# Altium schematic sheet ldo1.1.SchDoc
size A4; SheetNumber: 7; SheetTotal: 9
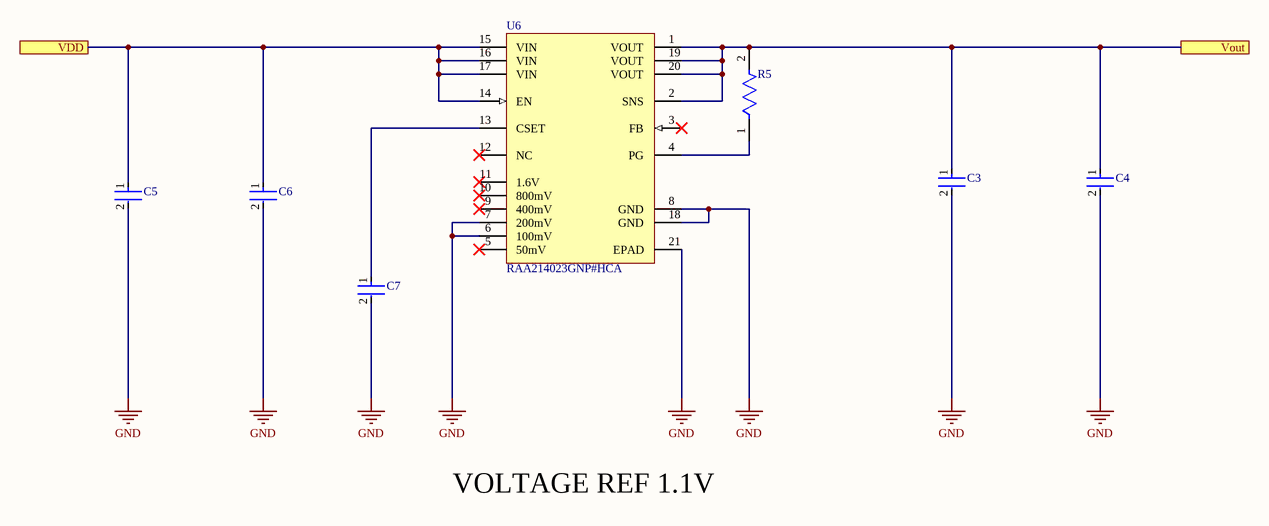
[diagram p0: ldo1.1.SchDoc]

## Parts
C3  CL21A226MOCLRNC  [FP-CL21-IPC_C]  (value not drawn)
C4  C0805C104K4RAC  [FP-C0805C-DN-MFG]  (value not drawn)
C5  0.1 uF C0805C104K4RAC  [FP-C0805C-DN-MFG]  (value not drawn)
C6  CL21A106KOQNNNG  [FP-CL21-IPC_C]  (value not drawn)
C7  C0805C104K4RAC  [FP-C0805C-DN-MFG]  (value not drawn)
R5  RC1005F103CS  [FP-RC1005-IPC_B]  (value not drawn)
U6  RAA214023GNP#HCA  [L20_3_5x3_5_MFG]

## Ports
VDD (see THE_FIRST[10G], DP10[1B], DP[2B], LDO3.3[1B], ldo[1B], lm334sm[2B]), Vout (see THE_FIRST[9G])

## Nets
GND: C3.2 C4.2 C5.2 C6.2 C7.2 U6.6(100mV) U6.7(200mV) U6.8(GND) U6.18(GND) U6.21(EPAD)
VDD: C5.1 C6.1 U6.14(EN) U6.15(VIN) U6.16(VIN) U6.17(VIN) ; port VDD
Vout: C3.1 C4.1 R5.2 U6.1(VOUT) U6.2(SNS) U6.19(VOUT) U6.20(VOUT) ; port Vout
NetC7_1: C7.1 U6.13(CSET)
NetR5_1: R5.1 U6.4(PG)

Not connected (* = marked no-connect by the designer): U6 3(FB)* 5(50mV)* 9(400mV)* 10(800mV)* 11(1.6V)* 12(NC)*

## Notes on the sheet
- VOLTAGE REF 1.1V

## Library data of the parts
C3 = CMP-13271-002990-1: CL21 Series 0805 22uF 16V ±20% Tolerance X5R Multilayer Ceramic Chip Capacitor; Case Code (Imperial): 0805; Capacitance: 22uF; Max Operating Temperature: 85°C; Min Operating Temperature: -55°C; Packaging: Tape and Reel; Case Code (Metric): 2012; Case/Package: 0805; Mount: Surface Mount; Tolerance: 20%; Thickness: 0.037inch; Voltage Rating: 16V; Width: 0.049inch; Length: 0.079inch
C4 C7 = CMP-03020-009592-2: C0805 0.10 μF X7R 30ppm/°C 10.00% 16 V; Manufacturer: KEMET; Material: Ceramic; Capacitance: 0.10 μF; Tolerance: 0.1; Value: 0.10 μF; Voltage Rating: 16 V; ComponentLink2Description: Datasheet; Category: Cap; Package: C0805C-DN; Device Class L1: Passive Components; Device Class L3: Ceramic Capacitors; RoHS: TRUE; Height: 0.88mm; Automotive: No; Temperature Range High: +125°C; Octopart: https://octopart.com/c0805c104k4rac-kemet-1343167; Mouser Description: Cap Ceramic 0.1uF 16V X7R 10% Pad SMD 0805 125C Bulk; Lead Free: Yes; Temperature Coefficient: 30ppm/°C; Ipc Land Pattern Name: CAPC200125X78; Manufacturer Part Number: C0805C104K4RAC; Temperature Characteristic: X7R; Device Class L2: Capacitors; Temperature Range Low: -55°C; Temperature: -55°C to +125°C; ComponentLink2URL: https://content.kemet.com/datasheets/KEM_C1003_C0G_SMD.pdf
C5 = CMP-03020-009592-2: C0805 0.10 μF X7R 30ppm/°C 10.00% 16 V / C0805C104K4RAC; Manufacturer: KEMET; Material: Ceramic; Capacitance: 0.10 μF; Tolerance: 0.1; Value: 0.10 μF; Voltage Rating: 16 V; ComponentLink2Description: Datasheet; Category: Cap; Package: C0805C-DN; Device Class L1: Passive Components; Device Class L3: Ceramic Capacitors; RoHS: TRUE; Height: 0.88mm; Automotive: No; Temperature Range High: +125°C; Octopart: https://octopart.com/c0805c104k4rac-kemet-1343167; Mouser Description: Cap Ceramic 0.1uF 16V X7R 10% Pad SMD 0805 125C Bulk; Lead Free: Yes; Temperature Coefficient: 30ppm/°C; Ipc Land Pattern Name: CAPC200125X78; Manufacturer Part Number: C0805C104K4RAC; Temperature Characteristic: X7R; Device Class L2: Capacitors; Temperature Range Low: -55°C; Temperature: -55°C to +125°C; ComponentLink2URL: https://content.kemet.com/datasheets/KEM_C1003_C0G_SMD.pdf
C6 = CMP-13271-002240-1: CL21 Series 0805 10uF 16V ±10% Tolerance X5R Multilayer Ceramic Chip Capacitor; Capacitance: 10uF; Case Code (Metric): 2012; Package Quantity: 3000; Width: 0.049inch; Mount: Surface Mount; Depth: 1.25mm; Material: Ceramic; Min Operating Temperature: -55°C; Thickness: 0.053inch; Tolerance: 10%; Case Code (Imperial): 0805; Packaging: Tape and Reel; Voltage Rating: 16V; Case/Package: 0805; Height: 1.25mm; Voltage: 16V; Max Operating Temperature: 85°C; Length: 2mm; Dielectric: X5R
R5 = CMP-13261-004522-1: Res Thick Film 0402 10kΩ 1% 0.063W ±100ppm/°C Molded SMD T/R; Max Power Dissipation: 63mW; Resistance: 10kR; Power Rating: 62.5mW; Package Quantity: 1; Depth: 0.5mm; Radiation Hardening: No; Features: Moisture Resistant; Max Operating Temperature: 155°C; Case Code (Metric): 1005; Military Standard: Not; Case/Package: 0402; Width: 0.02inch; Contact Plating: Tin; Mount: Surface Mount; Packaging: Tape and Reel; Height: 0.016inch; Case Code (Imperial): 0402; Number of Terminations: 2; Composition: Thick Film; Temperature Coefficient: 100ppm/°C; Min Operating Temperature: -55°C; Tolerance: 1%; Length: 1mm
U6 = CMP-00572-126438255-2: LDO Voltage Regulators 2A Low Noise LDO, 20 Lead 3.5x3.5 QFN (NiPdAu-Ag lead finish; Manufacturer Lifecycle Status: ACTIVE; Min Output Voltage: 5V; Max Junction Temperature (Tj): 150°C; Dropout Voltage: 420mV; Max Supply Voltage: 5.5V; Output Voltage: 800mV; Quiescent Current: 195µA; Min Supply Voltage: 2.7V; RAM Size: 1.5kB; Pitch: 500µm; Case/Package: QFN; Width: 3.5mm; ComponentLink3Description: Manufacturer's Package Drawing; ComponentLink1Description: Manufacturer's Website; HelpURL: https://octopart.com/cad-content/api/get-model-datasheet/15189/126438255; ComponentLink3URL: https://www.renesas.com/en/document/psc/l2035x35-20-lead-quad-flat-no-lead-package-qfn; Height: 900µm; Max Operating Temperature: 85°C; Number of Pins: 20; Max Output Current: 2A; Max Input Voltage: 5.5V; Length: 3.5mm; ComponentLink2URL: https://octopart.com/cad-content/api/get-model-datasheet/15189/126438255; ComponentLink2Description: Datasheet URL; Min Input Voltage: 2.7V; Mount: Surface Mount; Max Output Voltage: 800mV; RoHS: Compliant; ComponentLink1URL: http://www.renesas.com; Min Operating Temperature: -40°C; Lifecycle Status: Production